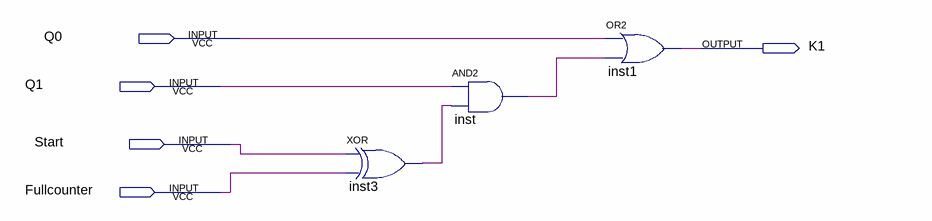
[diagram p0: schematic sheet]
// Quartus schematic K1.bdf as structural Verilog: 3 symbols, 5 pins
module K1 (
  input  Q0,
  input  Q1,
  input  Start,
  input  Fullcounter,
  output K1
);

  wire inst3_out, inst_out;

  xor inst3 (inst3_out, Start, Fullcounter);
  and inst (inst_out, Q1, inst3_out);
  or inst1 (K1, Q0, inst_out);
endmodule
